# EAGLE design IRIS1304_v2.22 (EAGLE 6.6.0)

## Sheet 1 of 4
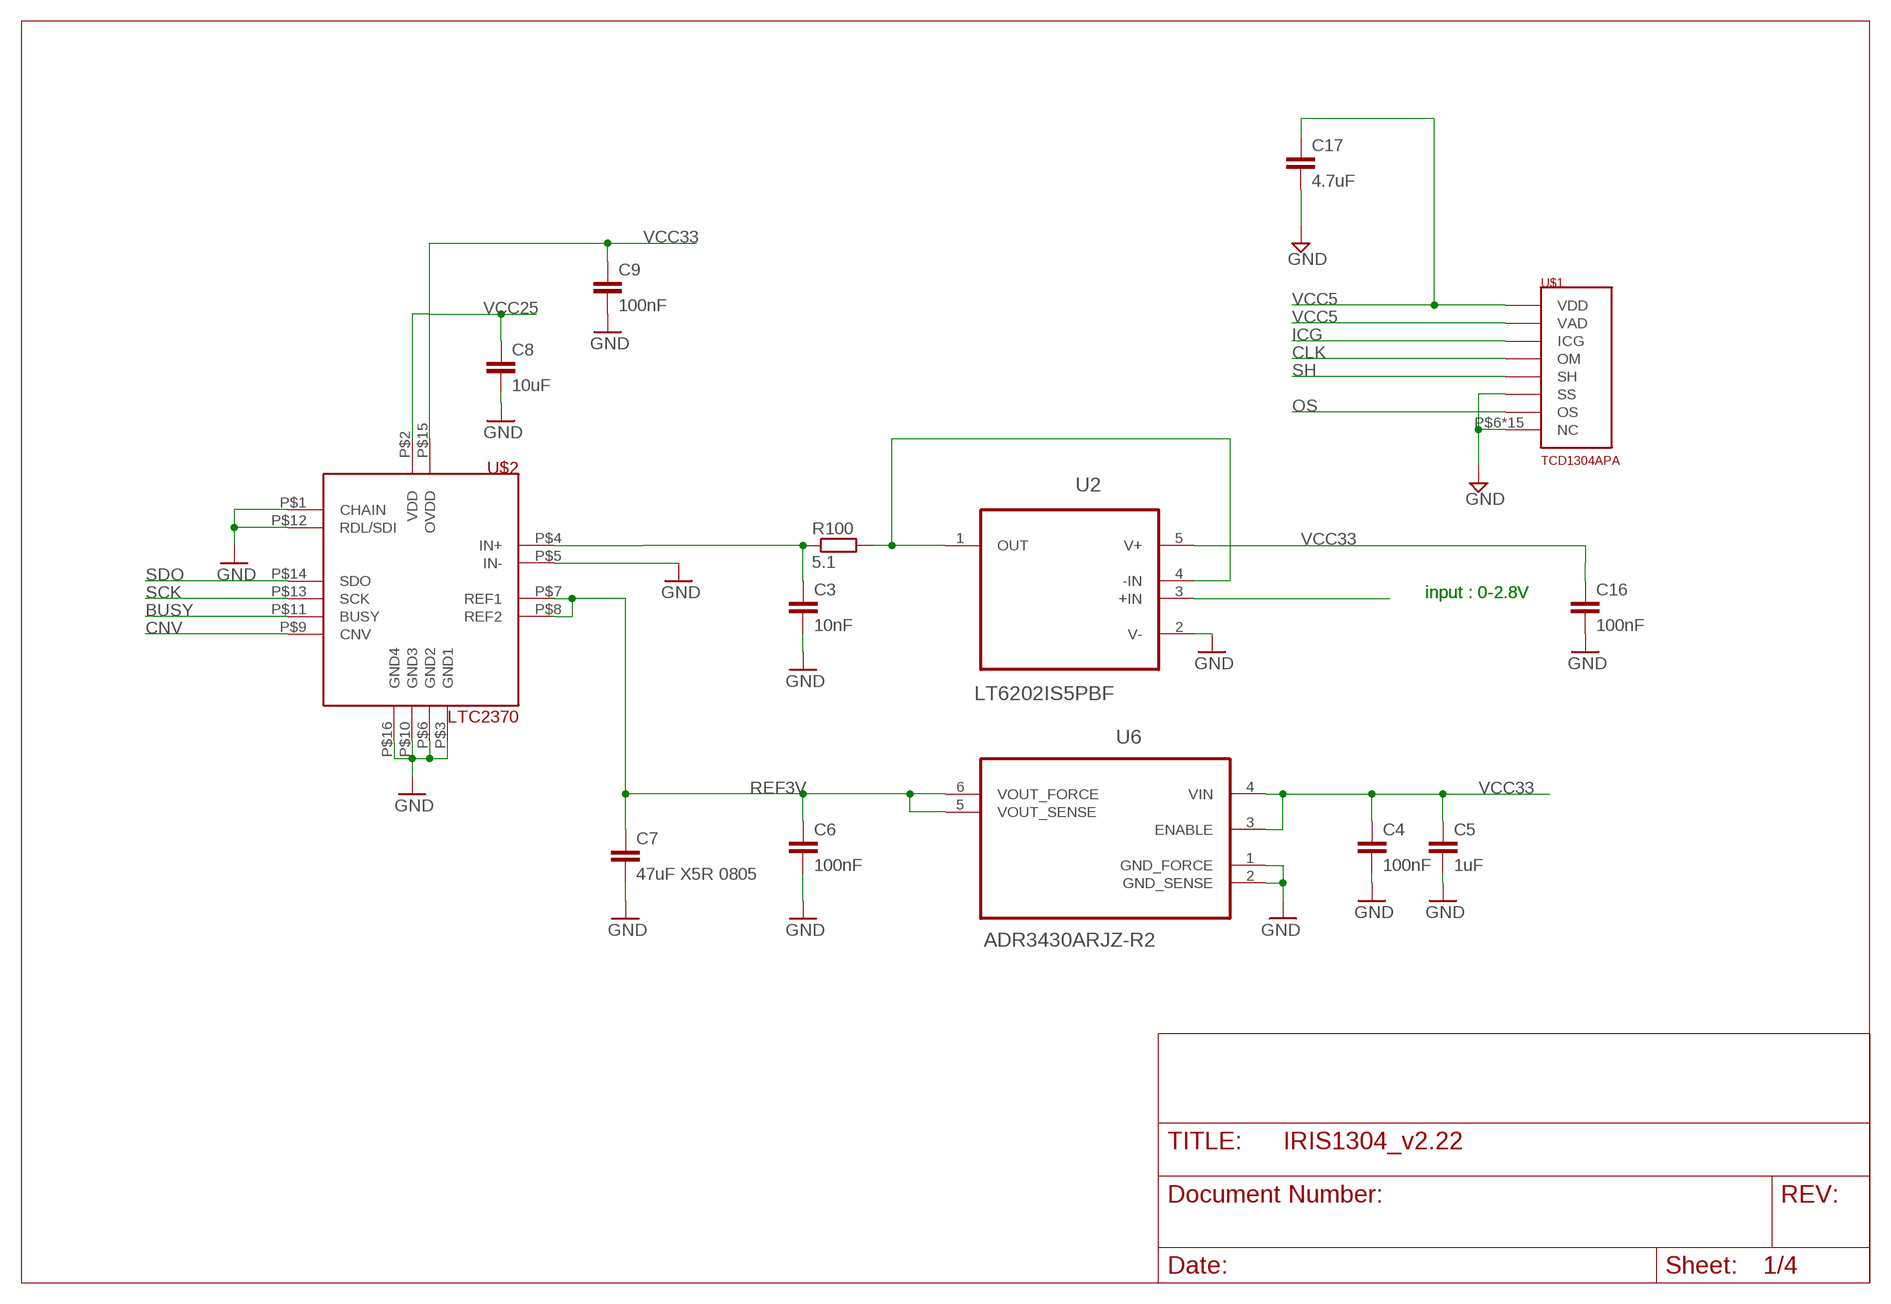
[diagram p0: schematic, sheet 1]

### Parts
C3  10nF  C-EUC0603  [C0603]
C4  100nF  C-EUC0603  [C0603]
C5  1uF  C-EUC0603  [C0603]
C6  100nF  C-EUC0603  [C0603]
C7  47uF X5R 0805  C-EUC0805  [C0805]
C8  10uF  C-EUC0603  [C0603]
C9  100nF  C-EUC0603  [C0603]
C16  100nF  C-EUC0603  [C0603]
C17  4.7uF  C-EUC0603  [C0603]
R100  5.1  R-EU_R0603  [R0603]
U2  LT6202IS5PBF  [SOT95P280X100-5N]
U6  ADR3430ARJZ-R2  [SOT95P280X145-6N]
U$1  TCD1304APA  [ILX511]
U$2  LTC2370  [MSOP-16]

### Nets
BUSY: U$2.P$11(BUSY) ; also sheet 2
CLK: U$1.P$4(OM) ; also sheet 2
CNV: U$2.P$9(CNV) ; also sheet 2
GND: C3.2 C4.2 C5.2 C6.2 C7.2 C8.2 C9.2 C16.2 C17.2 U2.2(V-) U6.1(GND_FORCE) U6.2(GND_SENSE) U$1.P$6(NC) U$1.P$7(NC) U$1.P$8(NC) U$1.P$9(NC) U$1.P$10(NC) U$1.P$11(NC) U$1.P$12(NC) U$1.P$13(NC) U$1.P$14(NC) U$1.P$15(NC) U$1.P$16(NC) U$1.P$17(NC) U$1.P$18(NC) U$1.P$19(NC) U$1.P$20(NC) U$1.P$22(SS) U$2.P$1(CHAIN) U$2.P$3(GND1) U$2.P$5(IN-) U$2.P$6(GND2) U$2.P$10(GND3) U$2.P$12(RDL/SDI) U$2.P$16(GND4) ; also sheet 2,3,4
ICG: U$1.P$3(ICG) ; also sheet 2
N$3: C3.1 R100.1 U$2.P$4(IN+)
N$11: R100.2 U2.1(OUT) U2.4(-IN)
OS: U2.3(+IN) U$1.P$21(OS)
REF3V: C6.1 C7.1 U6.5(VOUT_SENSE) U6.6(VOUT_FORCE) U$2.P$7(REF1) U$2.P$8(REF2)
SCK: U$2.P$13(SCK) ; also sheet 2
SDO: U$2.P$14(SDO) ; also sheet 2
SH: U$1.P$5(SH) ; also sheet 2
VCC5: C17.1 U$1.P$1(VDD) U$1.P$2(VAD) ; also sheet 3,4
VCC25: C8.1 U$2.P$2(VDD) ; also sheet 4
VCC33: C4.1 C5.1 C9.1 C16.1 U2.5(V+) U6.3(ENABLE) U6.4(VIN) U$2.P$15(OVDD) ; also sheet 2,3,4

### Notes on the sheet
- input : 0-2.8V | input : 0-2.8V

## Sheet 2 of 4
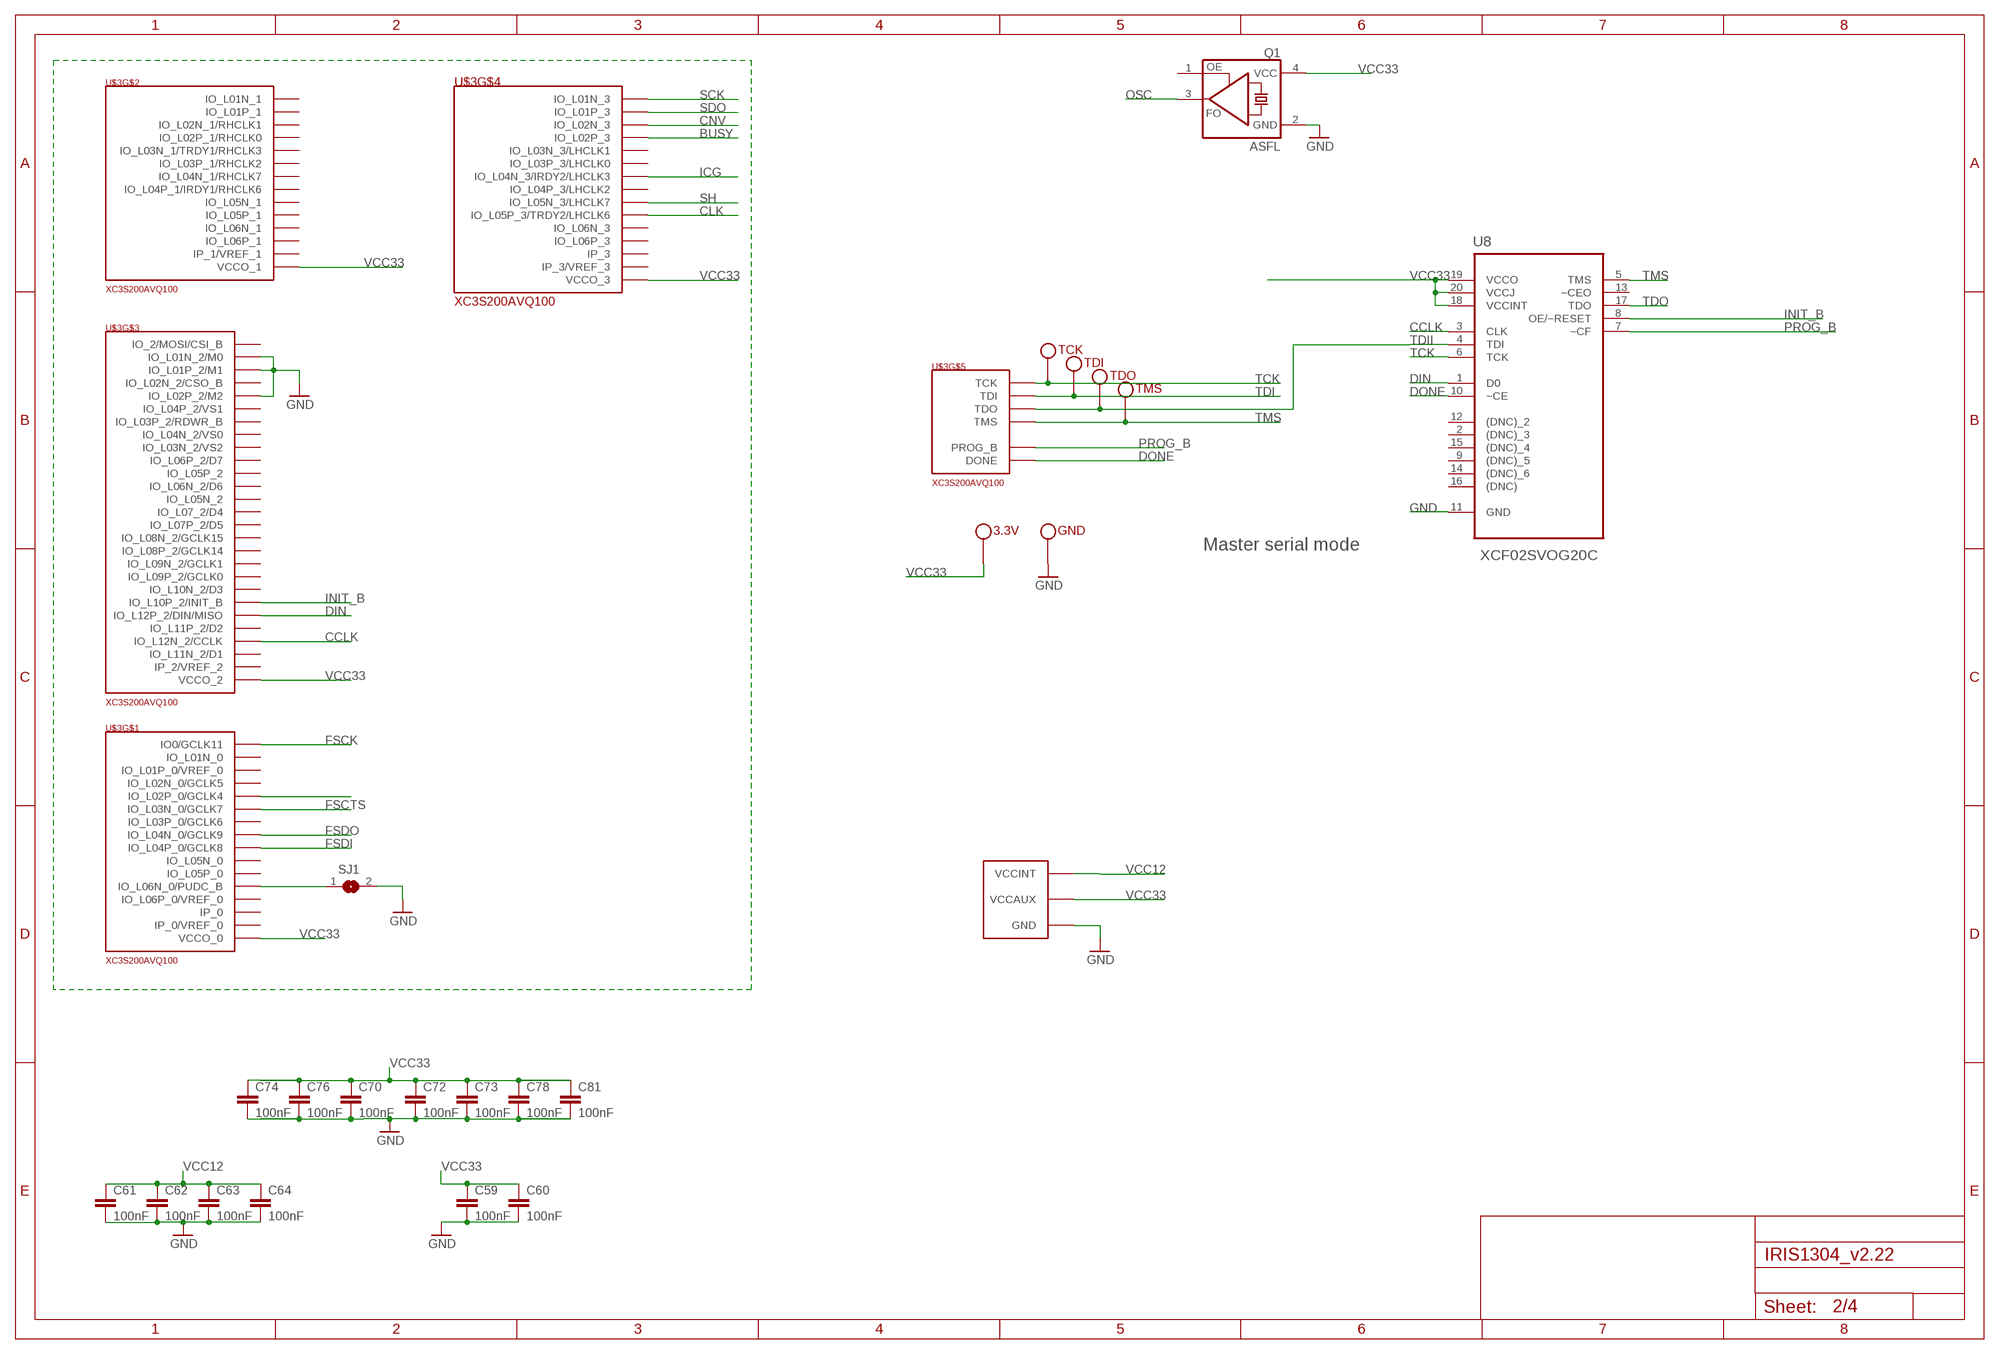
[diagram p1: schematic, sheet 2]

### Parts
3.3V  TEST  [TEST]
C59  100nF  C-EUC0603  [C0603]
C60  100nF  C-EUC0603  [C0603]
C61  100nF  C-EUC0603  [C0603]
C62  100nF  C-EUC0603  [C0603]
C63  100nF  C-EUC0603  [C0603]
C64  100nF  C-EUC0603  [C0603]
C70  100nF  C-EUC0603  [C0603]
C72  100nF  C-EUC0603  [C0603]
C73  100nF  C-EUC0603  [C0603]
C74  100nF  C-EUC0603  [C0603]
C76  100nF  C-EUC0603  [C0603]
C78  100nF  C-EUC0603  [C0603]
C81  100nF  C-EUC0603  [C0603]
GND  TEST  [TEST]
Q1  ASFL  [ASF]
SJ1  SJ  [SJ]
TCK  TEST  [TEST]
TDI  TEST  [TEST]
TDO  TEST  [TEST]
TMS  TEST  [TEST]
U8  XCF02SVOG20C  [SOP65P640X119-20N]
U$3  XC3S200AVQ100  [VQ100]

### Nets
BUSY: U$3.P5(IO_L02P_3) ; also sheet 1
CCLK: U8.3(CLK) U$3.P53(IO_L12N_2/CCLK)
CLK: U$3.P15(IO_L05P_3/TRDY2/LHCLK6) ; also sheet 1
CNV: U$3.P6(IO_L02N_3) ; also sheet 1
DIN: U8.1(D0) U$3.P51(IO_L12P_2/DIN/MISO)
DONE: U8.10(~CE) U$3.P54(DONE)
FSCK: U$3.P90(IO0/GCLK11) ; also sheet 3
FSCTS: U$3.P86(IO_L03N_0/GCLK7) ; also sheet 3
FSDI: U$3.P88(IO_L04P_0/GCLK8) ; also sheet 3
FSDO: U$3.P89(IO_L04N_0/GCLK9) ; also sheet 3
GND: C59.2 C60.2 C61.2 C62.2 C63.2 C64.2 C70.2 C72.2 C73.2 C74.2 C76.2 C78.2 C81.2 GND.P$1 Q1.2(GND) SJ1.2 U8.11(GND) U$3.P8(GND) U$3.P14(GND) U$3.P18(GND) U$3.P23(IO_L01P_2/M1) U$3.P24(IO_L02P_2/M2) U$3.P25(IO_L01N_2/M0) U$3.P42(GND) U$3.P47(GND) U$3.P58(GND) U$3.P63(GND) U$3.P69(GND) U$3.P74(GND) U$3.P80(GND) U$3.P87(GND) U$3.P91(GND) U$3.P95(GND) ; also sheet 1,3,4
ICG: U$3.P13(IO_L04N_3/IRDY2/LHCLK3) ; also sheet 1
INIT_B: U8.8(OE/~RESET) U$3.P48(IO_L10P_2/INIT_B)
N$1: SJ1.1 U$3.P99(IO_L06N_0/PUDC_B)
OSC: Q1.3(FO) U$3.P83(IO_L02P_0/GCLK4)
PROG_B: U8.7(~CF) U$3.P100(PROG_B)
SCK: U$3.P4(IO_L01N_3) ; also sheet 1
SDO: U$3.P3(IO_L01P_3) ; also sheet 1
SH: U$3.P16(IO_L05N_3/LHCLK7) ; also sheet 1
TCK: TCK.P$1 U8.6(TCK) U$3.P76(TCK)
TDI: TDI.P$1 U$3.P2(TDI)
TDII: TDO.P$1 U8.4(TDI) U$3.P75(TDO)
TDO: U8.17(TDO)
TMS: TMS.P$1 U8.5(TMS) U$3.P1(TMS)
VCC12: C61.1 C62.1 C63.1 C64.1 U$3.P17(VCCINT) U$3.P38(VCCINT) U$3.P66(VCCINT) U$3.P81(VCCINT) ; also sheet 4
VCC33: 3.3V.P$1 C59.1 C60.1 C70.1 C72.1 C73.1 C74.1 C76.1 C78.1 C81.1 Q1.4(VCC) U8.18(VCCINT) U8.19(VCCO) U8.20(VCCJ) U$3.P11(VCCO_3) U$3.P22(VCCAUX) U$3.P26(VCCO_2) U$3.P45(VCCO_2) U$3.P55(VCCAUX) U$3.P67(VCCO_1) U$3.P79(VCCO_0) U$3.P92(VCCAUX) U$3.P96(VCCO_0) ; also sheet 1,3,4
Unconnected: Q1.1(OE) U8.2((DNC)_3) U8.9((DNC)_5) U8.12((DNC)_2) U8.13(~CEO) U8.14((DNC)_6) U8.15((DNC)_4) U8.16((DNC)) U$3.P7(IP_3/VREF_3) U$3.P9(IO_L03P_3/LHCLK0) U$3.P10(IO_L03N_3/LHCLK1) U$3.P12(IO_L04P_3/LHCLK2) U$3.P19(IO_L06P_3) U$3.P20(IO_L06N_3) U$3.P21(IP_3) U$3.P27(IO_L02N_2/CSO_B) U$3.P28(IO_L03P_2/RDWR_B) U$3.P29(IO_L03N_2/VS2) U$3.P30(IO_L04P_2/VS1) U$3.P31(IO_L04N_2/VS0) U$3.P32(IO_L05P_2) U$3.P33(IO_L05N_2) U$3.P34(IO_L06P_2/D7) U$3.P35(IO_L06N_2/D6) U$3.P36(IO_L07P_2/D5) U$3.P37(IO_L07_2/D4) U$3.P39(IP_2/VREF_2) U$3.P40(IO_L08P_2/GCLK14) U$3.P41(IO_L08N_2/GCLK15) U$3.P43(IO_L09P_2/GCLK0) U$3.P44(IO_L09N_2/GCLK1) U$3.P46(IO_2/MOSI/CSI_B) U$3.P49(IO_L10N_2/D3) U$3.P50(IO_L11P_2/D2) U$3.P52(IO_L11N_2/D1) U$3.P56(IO_L01P_1) U$3.P57(IO_L01N_1) U$3.P59(IO_L02P_1/RHCLK0) U$3.P60(IO_L02N_1/RHCLK1) U$3.P61(IO_L03P_1/RHCLK2) U$3.P62(IO_L03N_1/TRDY1/RHCLK3) U$3.P64(IO_L04P_1/IRDY1/RHCLK6) U$3.P65(IO_L04N_1/RHCLK7) U$3.P68(IP_1/VREF_1) U$3.P70(IO_L05P_1) U$3.P71(IO_L05N_1) U$3.P72(IO_L06P_1) U$3.P73(IO_L06N_1) U$3.P77(IO_L01P_0/VREF_0) U$3.P78(IO_L01N_0) U$3.P82(IP_0/VREF_0) U$3.P84(IO_L02N_0/GCLK5) U$3.P85(IO_L03P_0/GCLK6) U$3.P93(IO_L05P_0) U$3.P94(IO_L05N_0) U$3.P97(IP_0) U$3.P98(IO_L06P_0/VREF_0)

### Notes on the sheet
- Master serial mode

## Sheet 3 of 4
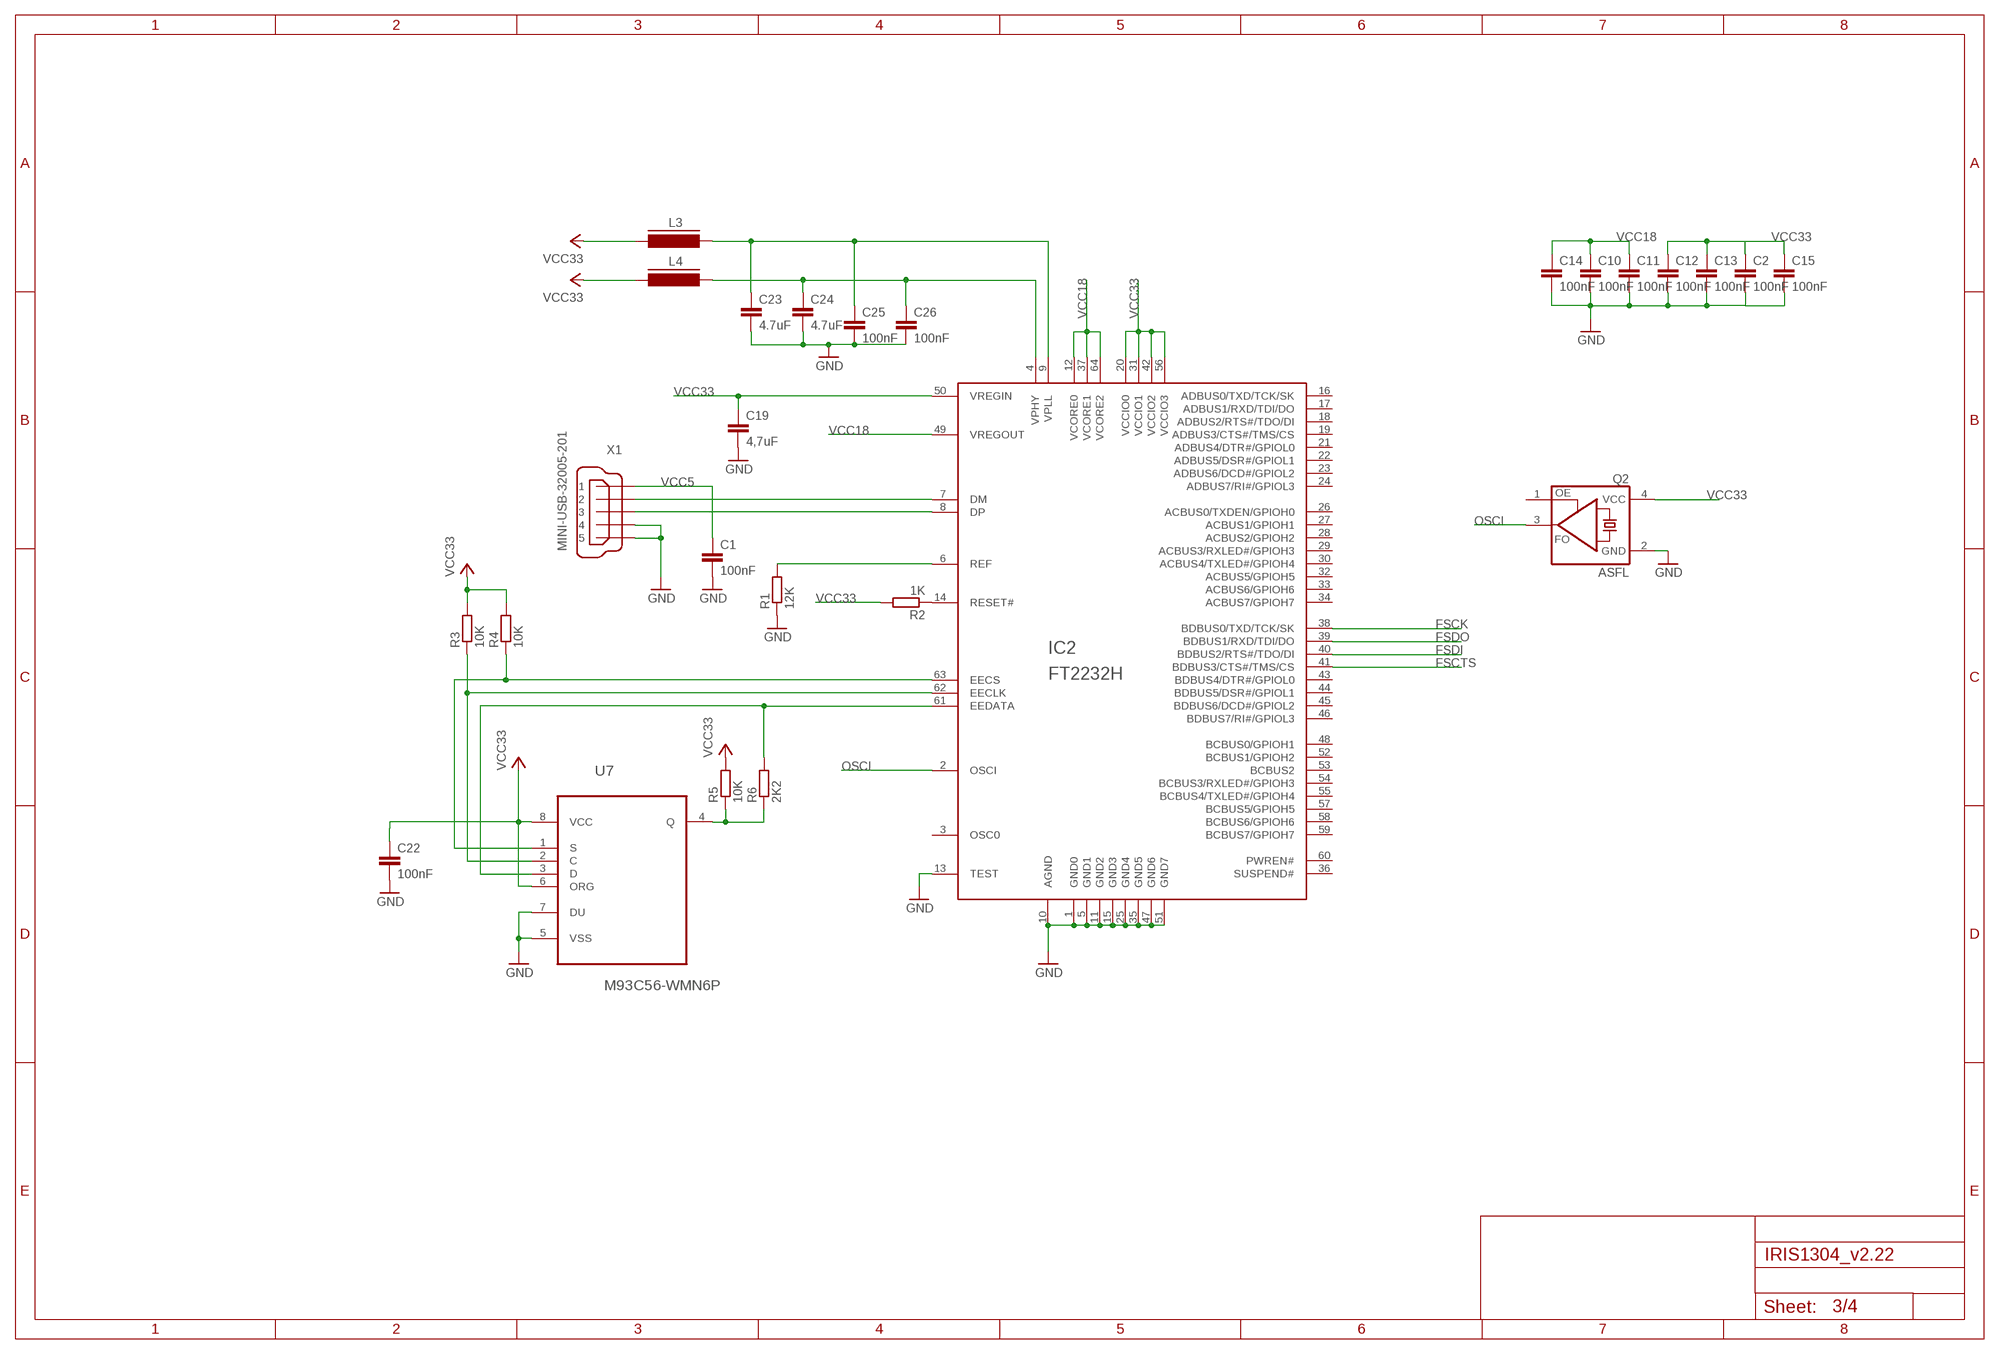
[diagram p2: schematic, sheet 3]

### Parts
C1  100nF  C-EUC0603  [C0603]
C2  100nF  C-EUC0603  [C0603]
C10  100nF  C-EUC0603  [C0603]
C11  100nF  C-EUC0603  [C0603]
C12  100nF  C-EUC0603  [C0603]
C13  100nF  C-EUC0603  [C0603]
C14  100nF  C-EUC0603  [C0603]
C15  100nF  C-EUC0603  [C0603]
C19  4,7uF  C-EUC0805  [C0805]
C22  100nF  C-EUC0603  [C0603]
C23  4.7uF  C-EUC0603  [C0603]
C24  4.7uF  C-EUC0603  [C0603]
C25  100nF  C-EUC0603  [C0603]
C26  100nF  C-EUC0603  [C0603]
IC2  FT2232H  [LQFP64]
L3  FERRITE_BEAD805  [FB805]
L4  FERRITE_BEAD805  [FB805]
Q2  ASFL  [ASF]
R1  12K  R-EU_R0603  [R0603]
R2  1K  R-EU_R0603  [R0603]
R3  10K  R-EU_R0603  [R0603]
R4  10K  R-EU_R0603  [R0603]
R5  10K  R-EU_R0603  [R0603]
R6  2K2  R-EU_R0603  [R0603]
U7  M93C56-WMN6P  [SOIC127P600X175-8N]
X1  MINI-USB-32005-201  [32005-201]

### Nets
D+: IC2.8(DP) X1.3
D-: IC2.7(DM) X1.2
FSCK: IC2.38(BDBUS0/TXD/TCK/SK) ; also sheet 2
FSCTS: IC2.41(BDBUS3/CTS#/TMS/CS) ; also sheet 2
FSDI: IC2.40(BDBUS2/RTS#/TDO/DI) ; also sheet 2
FSDO: IC2.39(BDBUS1/RXD/TDI/DO) ; also sheet 2
GND: C1.2 C2.2 C10.2 C11.2 C12.2 C13.2 C14.2 C15.2 C19.2 C22.2 C23.2 C24.2 C25.2 C26.2 IC2.1(GND0) IC2.5(GND1) IC2.10(AGND) IC2.11(GND2) IC2.13(TEST) IC2.15(GND3) IC2.25(GND4) IC2.35(GND5) IC2.47(GND6) IC2.51(GND7) Q2.2(GND) R1.1 U7.5(VSS) U7.7(DU) X1.4 X1.5 ; also sheet 1,2,4
N$8: IC2.6(REF) R1.2
N$9: R5.1 R6.1 U7.4(Q)
N$12: IC2.61(EEDATA) R6.2 U7.3(D)
N$13: IC2.63(EECS) R4.1 U7.1(S)
N$17: IC2.62(EECLK) R3.1 U7.2(C)
N$18: C24.1 C26.1 IC2.4(VPHY) L4.1
N$19: C23.1 C25.1 IC2.9(VPLL) L3.1
N$20: IC2.14(RESET#) R2.1
OSCI: IC2.2(OSCI) Q2.3(FO)
VCC5: C1.1 X1.1 ; also sheet 1,4
VCC18: C10.1 C11.1 C14.1 IC2.12(VCORE0) IC2.37(VCORE1) IC2.49(VREGOUT) IC2.64(VCORE2)
VCC33: C2.1 C12.1 C13.1 C15.1 C19.1 C22.1 IC2.20(VCCIO0) IC2.31(VCCIO1) IC2.42(VCCIO2) IC2.50(VREGIN) IC2.56(VCCIO3) L3.2 L4.2 Q2.4(VCC) R2.2 R3.2 R4.2 R5.2 U7.6(ORG) U7.8(VCC) ; also sheet 1,2,4
Unconnected: IC2.3(OSC0) IC2.16(ADBUS0/TXD/TCK/SK) IC2.17(ADBUS1/RXD/TDI/DO) IC2.18(ADBUS2/RTS#/TDO/DI) IC2.19(ADBUS3/CTS#/TMS/CS) IC2.21(ADBUS4/DTR#/GPIOL0) IC2.22(ADBUS5/DSR#/GPIOL1) IC2.23(ADBUS6/DCD#/GPIOL2) IC2.24(ADBUS7/RI#/GPIOL3) IC2.26(ACBUS0/TXDEN/GPIOH0) IC2.27(ACBUS1/GPIOH1) IC2.28(ACBUS2/GPIOH2) IC2.29(ACBUS3/RXLED#/GPIOH3) IC2.30(ACBUS4/TXLED#/GPIOH4) IC2.32(ACBUS5/GPIOH5) IC2.33(ACBUS6/GPIOH6) IC2.34(ACBUS7/GPIOH7) IC2.36(SUSPEND#) IC2.43(BDBUS4/DTR#/GPIOL0) IC2.44(BDBUS5/DSR#/GPIOL1) IC2.45(BDBUS6/DCD#/GPIOL2) IC2.46(BDBUS7/RI#/GPIOL3) IC2.48(BCBUS0/GPIOH1) IC2.52(BCBUS1/GPIOH2) IC2.53(BCBUS2) IC2.54(BCBUS3/RXLED#/GPIOH3) IC2.55(BCBUS4/TXLED#/GPIOH4) IC2.57(BCBUS5/GPIOH5) IC2.58(BCBUS6/GPIOH6) IC2.59(BCBUS7/GPIOH7) IC2.60(PWREN#) Q2.1(OE)

## Sheet 4 of 4
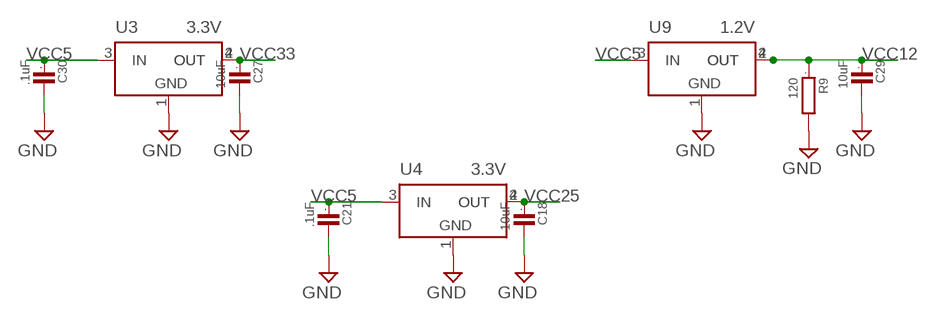
[diagram p3: schematic, sheet 4]

### Parts
C18  10uF  C0805  [0805]
C21  .1uF  C0805  [0805]
C27  10uF  C0805  [0805]
C29  10uF  C0805  [0805]
C30  .1uF  C0805  [0805]
R9  120  R0805  [0805@1]
U3  3.3V  LD1117  [SOT223]
U4  3.3V  LD1117  [SOT223]
U9  1.2V  LD1117  [SOT223]

### Nets
GND: C18.2 C21.2 C27.2 C29.2 C30.2 R9.2 U3.1(GND) U4.1(GND) U9.1(GND) ; also sheet 1,2,3
VCC5: C21.1 C30.1 U3.3(IN) U4.3(IN) U9.3(IN) ; also sheet 1,3
VCC12: C29.1 R9.1 U9.2(OUT) U9.4(OUT) ; also sheet 2
VCC25: C18.1 U4.2(OUT) U4.4(OUT) ; also sheet 1
VCC33: C27.1 U3.2(OUT) U3.4(OUT) ; also sheet 1,2,3

## Library data of the parts
3.3V GND TCK TDI TDO TMS = IRIS lib v1.0:TEST
C1 C3 = rcl:C-EU: CAPACITOR, European symbol; MF: AVX; MPN: 06035G103ZAT2A; OC_FARNELL: 317433
C2 C4 C6 C9-C16 C22 C25 C26 C59-C64 C70 C72-C74 C76 C78 C81 = rcl:C-EU: CAPACITOR, European symbol; MF: AVX; MPN: 06033G104ZAT2A; OC_FARNELL: 317287
C5 = rcl:C-EU: CAPACITOR, European symbol; MF: KEMET; MPN: C0603C105K3PACTU; OC_FARNELL: 1288202
C7 = rcl:C-EU: CAPACITOR, European symbol; MF: KEMET; MPN: C0805C476M9PACTU; OC_FARNELL: 1572633
C8 = rcl:C-EU: CAPACITOR, European symbol; MF: KEMET; MPN: C0603C106M9PACTU; OC_FARNELL: 1288201
C17 C23 C24 = rcl:C-EU: CAPACITOR, European symbol; MF: YAGEO (PHYCOMP); MPN: CC0603KRX5R6BB475; OC_FARNELL: 1458898
C18 C21 C27 C29 C30 = GadgetFactory:C: CAPACITOR, European symbol
C19 = rcl:C-EU: CAPACITOR, European symbol; MF: AVX; MPN: 0805ZD335KAT2A; OC_FARNELL: 1301817
IC2 = DP-EagleLibrary:FT2232H: DUAL HIGH SPEED USB TO MULTIPURPOSE UART/FIFO IC; MF: FTDI; MPN: FT2232HL-R; OC_FARNELL: 1697461
L3 L4 = dp_devices:FERRITE_BEAD; OC_FARNELL: unknown
Q1 Q2 = crystal:ASF*: CRYSTAL CLOCK OSCILLATORS 5.0 Vdc or 3.3 Vdc - LOW PROFILE ULTRA MINIATURE CERAMIC SURFACE MOUNT Source: http://www.abracon.com/Oscillators/asf1-L-L1.pdf; MF: ABRACON; MPN: ASFL1-12.000MHZ-EK-T; OC_FARNELL: 7943088; OC_NEWARK: 99M0411
R1 = rcl:R-EU_: RESISTOR, European symbol; MF: TE CONNECTIVITY; MPN: CPF0201D12K1C1; OC_FARNELL: 2117895
R2 = rcl:R-EU_: RESISTOR, European symbol; MF: VISHAY DRALORIC; MPN: CRCW06031K00FKEA; OC_FARNELL: 1469740
R3-R5 = rcl:R-EU_: RESISTOR, European symbol; MF: TE CONNECTIVITY / NEOHM; MPN: CPF0603F10KC1; OC_FARNELL: 1527581
R6 = rcl:R-EU_: RESISTOR, European symbol; MF: PANASONIC; MPN: ERJP03F2201V; OC_FARNELL: 1750676
R9 = Bogdan_Commons:R: RESISTOR, European symbol
R100 = rcl:R-EU_: RESISTOR, European symbol; MF: VISHAY DALE; MPN: CRCW06035R10FNEA; OC_FARNELL: 1563921
SJ1 = jumper:SJ: SMD solder JUMPER
U2 = SpectroLib:LT6202IS5PBF: Low Power Op Amps; MF: LINEAR TECHNOLOGY; MPN: LT6202IS5#PBF; OC_FARNELL: 2102627; OC_NEWARK: 84R3670; PACKAGE: TSOT-23-5; SUPPLIER: Linear Technology
U3 U4 U9 = GadgetFactory:LD1117
U6 = SpectroLib:ADR3430ARJZ-R2: Voltage References; MF: ANALOG DEVICES; MPN: ADR3430ARJZ-R2; OC_FARNELL: 1899425; OC_NEWARK: 76R7580; PACKAGE: SOT23-6; SUPPLIER: Analog Devices
U7 = IRIS:M93C56-WMN6P: MICROWIRE serial access EEPROM; MF: STMICROELECTRONICS; MPN: M93C56-WMN6P; OC_FARNELL: 9882448; OC_NEWARK: 26M1829; PACKAGE: SOIC-8; SUPPLIER: STMICROELECTRONICS
U8 = QUBIC:XCF02SVOG20C: Platform Flash In-System Programmable Configuration PROMS; DESCRIPTION: Platform Flash In-System Programmable Configuration PROMS; MF: XILINX; MPN: XCF02SVOG20C; OC_FARNELL: 1876178; OC_NEWARK: 40T2691; PACKAGE: TSSOP-20; SUPPLIER: XILINX
U$1 = SpectroLib:TCD1304AP; OC_FARNELL: unknown
U$2 = SpectroLib:LTC2370; MF: LINEAR TECHNOLOGY; MPN: LTC2370CMS-16; OC_FARNELL: 2068071
U$3 = IRIS lib v1.0:XC3S200AVQ100
X1 = con-cypressindustries:MINI-USB-: MINI USB-B Conector Source: www.cypressindustries.com; MF: WURTH ELEKTRONIK; MPN: 65100516121; OC_FARNELL: 1642036; OC_NEWARK: unknown

## Net classes
0 default: width 0.178 mm, drill 0.381 mm, clearance 0.178 mm

## Board
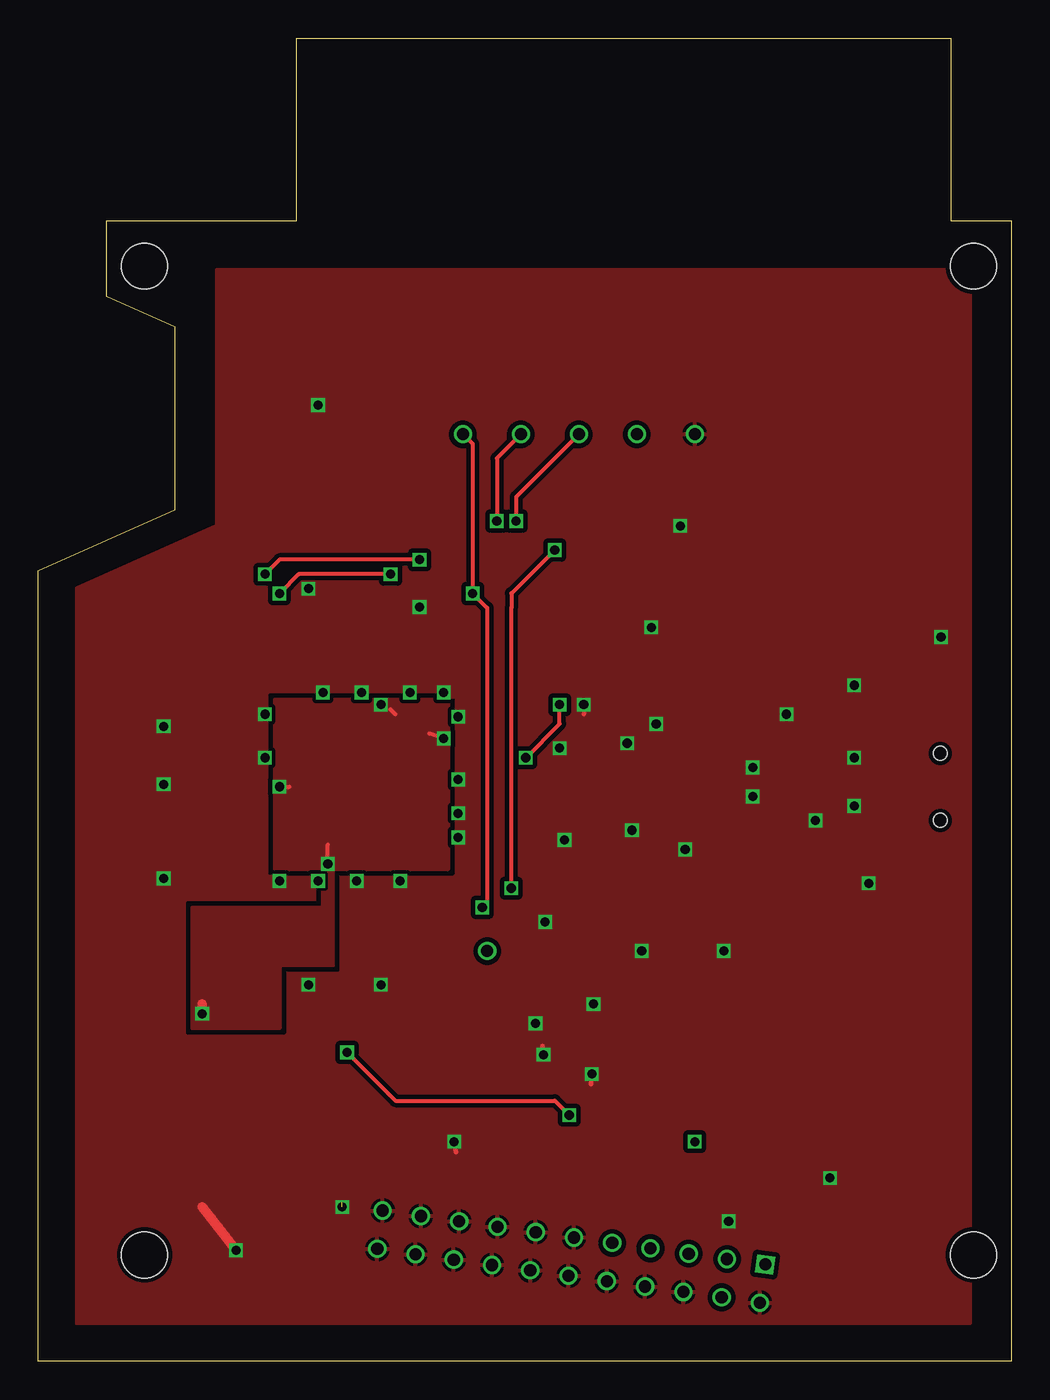
[diagram p4: board, top side]
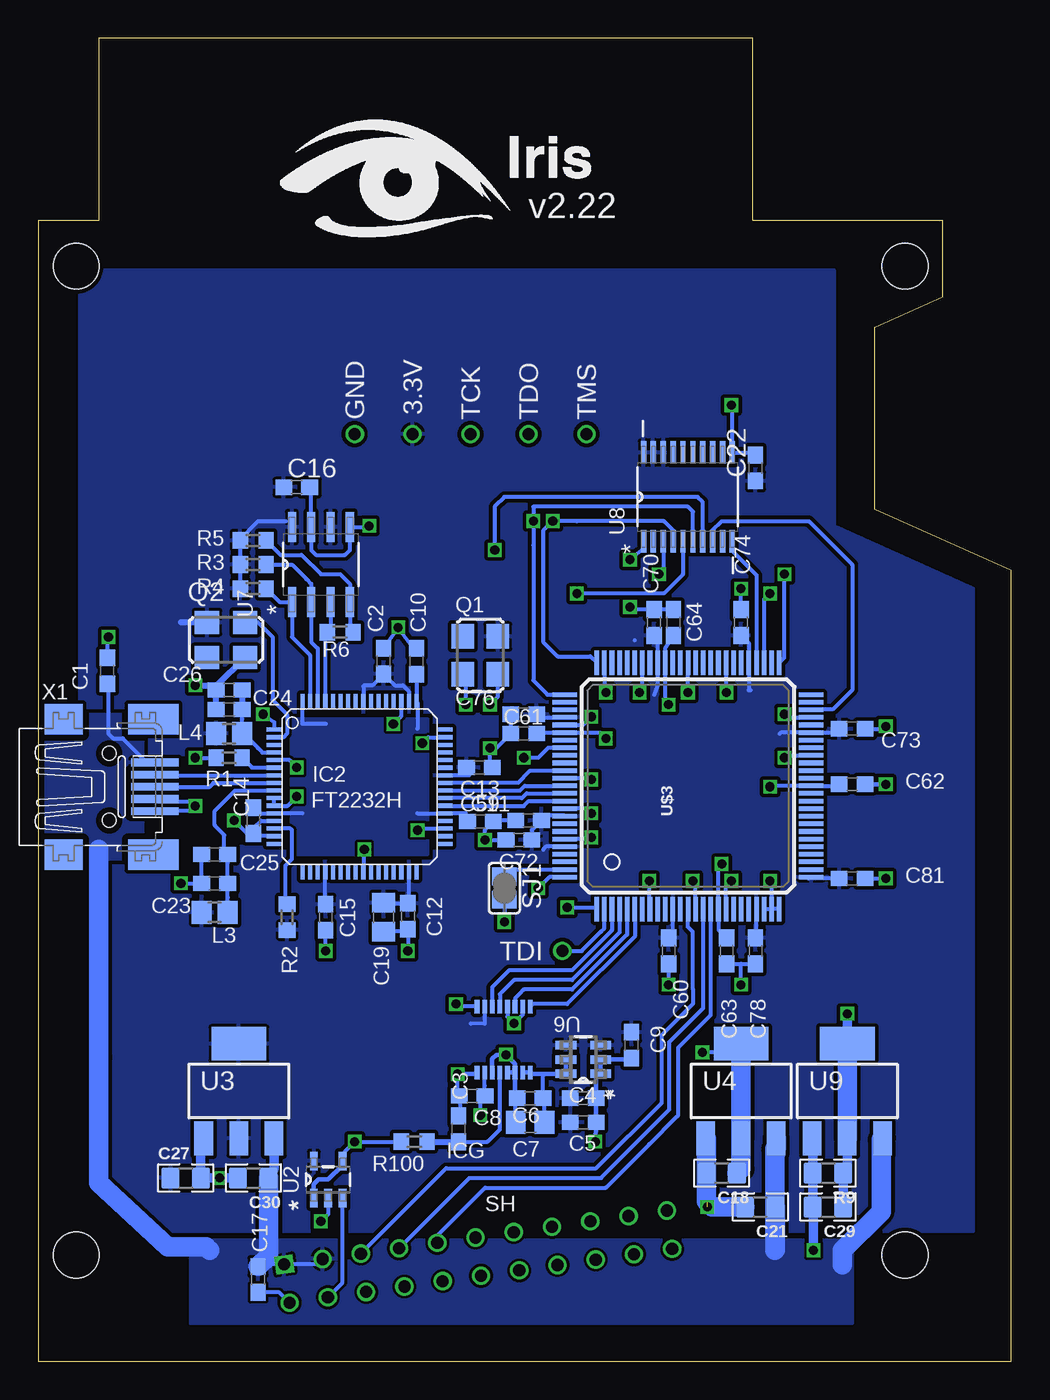
[diagram p5: board, bottom side, seen from below]

Size 64 x 87 mm. Coordinates in mm from the lower left corner, seen from the top.
Outline: 0,0 0,52 9,56 9,68 4.5,70 4.5,75 17,75 17,87 60,87 60,75 64,75 64,0 0,0
Copper layers (1*16): Top 0.035mm / dielectric 1.5mm / Bottom 0.035mm
Design rules "PCB-POOL Standard": minimum track width 0.15mm, minimum drill 0.3mm, track to track 0.15mm, track to pad 0.15mm, pad to pad 0.15mm, via to via 0.15mm, smd to smd 0.15mm, copper to edge 0.3mm, drill to drill 0.2mm, minimum pad ring 0.2mm, minimum via ring 0.15mm, stop-mask expansion 0.075mm, vias tented up to drill 0mil, thermal gap 0.2mm
Holes 3 mm at 7,72 61.5,72 61.5,7 7,7

### Footprints (pad centres in the part's own frame; a part is rotated, then mirrored left to right if it is on the bottom)
TEST = drill 0.8: P$1 0,0
C0603 = smd 1.1 x 1: 1 -0.85,0; 2 0.85,0
C0805 = smd 1.3 x 1.5: 1 -0.95,0; 2 0.95,0
0805 = smd 1.2 x 1.4: 1 -1,0; 2 1,0
LQFP64 = smd 1 x 0.27: 1 -5.6,3.75; 2 -5.6,3.25; 3 -5.6,2.75; 4 -5.6,2.25; 5 -5.6,1.75; 6 -5.6,1.25; 7 -5.6,0.75; 8 -5.6,0.25; 9 -5.6,-0.25; 10 -5.6,-0.75; 11 -5.6,-1.25; 12 -5.6,-1.75; 13 -5.6,-2.25; 14 -5.6,-2.75; 15 -5.6,-3.25; 16 -5.6,-3.75; 33 5.6,-3.75; 34 5.6,-3.25; 35 5.6,-2.75; 36 5.6,-2.25; 37 5.6,-1.75; 38 5.6,-1.25; 39 5.6,-0.75; 40 5.6,-0.25; 41 5.6,0.25; 42 5.6,0.75; 43 5.6,1.25; 44 5.6,1.75; 45 5.6,2.25; 46 5.6,2.75; 47 5.6,3.25; 48 5.6,3.75 | smd 0.27 x 1: 17 -3.75,-5.6; 18 -3.25,-5.6; 19 -2.75,-5.6; 20 -2.25,-5.6; 21 -1.75,-5.6; 22 -1.25,-5.6; 23 -0.75,-5.6; 24 -0.25,-5.6; 25 0.25,-5.6; 26 0.75,-5.6; 27 1.25,-5.6; 28 1.75,-5.6; 29 2.25,-5.6; 30 2.75,-5.6; 31 3.25,-5.6; 32 3.75,-5.6; 49 3.75,5.6; 50 3.25,5.6; 51 2.75,5.6; 52 2.25,5.6; 53 1.75,5.6; 54 1.25,5.6; 55 0.75,5.6; 56 0.25,5.6; 57 -0.25,5.6; 58 -0.75,5.6; 59 -1.25,5.6; 60 -1.75,5.6; 61 -2.25,5.6; 62 -2.75,5.6; 63 -3.25,5.6; 64 -3.75,5.6
FB805 = smd 1.3 x 1.5: 1 -0.85,0; 2 0.85,0
ASF = smd 1.6 x 1.5: 1 -1.25,-1.15; 2 1.25,-1.15; 3 1.25,1.15; 4 -1.25,1.15
R0603 = smd 1 x 1.1: 1 -0.85,0; 2 0.85,0
0805@1 = smd 1.2 x 1.4: 1 -1,0; 2 1,0
SJ = smd 1.168 x 1.6: 1 -0.762,0; 2 0.762,0
SOT95P280X100-5N = smd 1.219 x 0.508: 1 -1.219,0.94; 2 -1.219,0; 3 -1.219,-0.94; 4 1.219,-0.94; 5 1.219,0.94
SOT223 = smd 1.219 x 2.235: 1 -2.311,-3.099; 2 0,-3.099; 3 2.311,-3.099 | smd 3.6 x 2.2: 4 0,3.099
SOT95P280X145-6N = smd 1.372 x 0.559: 1 -1.143,0.94; 2 -1.143,0; 3 -1.143,-0.94; 4 1.143,-0.94; 5 1.143,0; 6 1.143,0.94
SOIC127P600X175-8N = smd 1.981 x 0.533: 1 -2.464,1.905; 2 -2.464,0.635; 3 -2.464,-0.635; 4 -2.464,-1.905; 5 2.464,-1.905; 6 2.464,-0.635; 7 2.464,0.635; 8 2.464,1.905
SOP65P640X119-20N = smd 1.473 x 0.356: 1 -2.921,2.921; 2 -2.921,2.286; 3 -2.921,1.626; 4 -2.921,0.965; 5 -2.921,0.33; 6 -2.921,-0.33; 7 -2.921,-0.965; 8 -2.921,-1.626; 9 -2.921,-2.286; 10 -2.921,-2.921; 11 2.921,-2.921; 12 2.921,-2.286; 13 2.921,-1.626; 14 2.921,-0.965; 15 2.921,-0.33; 16 2.921,0.33; 17 2.921,0.965; 18 2.921,1.626; 19 2.921,2.286; 20 2.921,2.921
ILX511 = drill 0.8 square: P$1 0,0 | drill 0.8: P$2 -2.54,0; P$3 -5.08,0; P$4 -7.62,0; P$5 -10.16,0; P$6 -12.7,0; P$7 -15.24,0; P$8 -17.78,0; P$9 -20.32,0; P$10 -22.86,0; P$11 -25.4,0; P$12 -25.4,-2.54; P$13 -22.86,-2.54; P$14 -20.32,-2.54; P$15 -17.78,-2.54; P$16 -15.24,-2.54; P$17 -12.7,-2.54; P$18 -10.16,-2.54; P$19 -7.62,-2.54; P$20 -5.08,-2.54; P$21 -2.54,-2.54; P$22 0,-2.54
MSOP-16 = smd 0.305 x 0.889: P$1 0,-4.34; P$2 0.5,-4.34; P$3 1,-4.34; P$4 1.5,-4.34; P$5 2,-4.34; P$6 2.5,-4.34; P$7 3,-4.34; P$8 3.5,-4.34; P$9 3.5,0; P$10 3,0; P$11 2.5,0; P$12 2,0; P$13 1.5,0; P$14 1,0; P$15 0.5,0; P$16 0,0
VQ100 = smd 1.6 x 0.3: P1 -8.1,6; P2 -8.1,5.5; P3 -8.1,5; P4 -8.1,4.5; P5 -8.1,4; P6 -8.1,3.5; P7 -8.1,3; P8 -8.1,2.5; P9 -8.1,2; P10 -8.1,1.5; P11 -8.1,1; P12 -8.1,0.5; P13 -8.1,0; P14 -8.1,-0.5; P15 -8.1,-1; P16 -8.1,-1.5; P17 -8.1,-2; P18 -8.1,-2.5; P19 -8.1,-3; P20 -8.1,-3.5; P21 -8.1,-4; P22 -8.1,-4.5; P23 -8.1,-5; P24 -8.1,-5.5; P25 -8.1,-6; P51 8.1,-6; P52 8.1,-5.5; P53 8.1,-5; P54 8.1,-4.5; P55 8.1,-4; P56 8.1,-3.5; P57 8.1,-3; P58 8.1,-2.5; P59 8.1,-2; P60 8.1,-1.5; P61 8.1,-1; P62 8.1,-0.5; P63 8.1,0; P64 8.1,0.5; P65 8.1,1; P66 8.1,1.5; P67 8.1,2; P68 8.1,2.5; P69 8.1,3; P70 8.1,3.5; P71 8.1,4; P72 8.1,4.5; P73 8.1,5; P74 8.1,5.5; P75 8.1,6 | smd 0.3 x 1.6: P26 -6,-8.1; P27 -5.5,-8.1; P28 -5,-8.1; P29 -4.5,-8.1; P30 -4,-8.1; P31 -3.5,-8.1; P32 -3,-8.1; P33 -2.5,-8.1; P34 -2,-8.1; P35 -1.5,-8.1; P36 -1,-8.1; P37 -0.5,-8.1; P38 0,-8.1; P39 0.5,-8.1; P40 1,-8.1; P41 1.5,-8.1; P42 2,-8.1; P43 2.5,-8.1; P44 3,-8.1; P45 3.5,-8.1; P46 4,-8.1; P47 4.5,-8.1; P48 5,-8.1; P49 5.5,-8.1; P50 6,-8.1; P76 6,8.1; P77 5.5,8.1; P78 5,8.1; P79 4.5,8.1; P80 4,8.1; P81 3.5,8.1; P82 3,8.1; P83 2.5,8.1; P84 2,8.1; P85 1.5,8.1; P86 1,8.1; P87 0.5,8.1; P88 0,8.1; P89 -0.5,8.1; P90 -1,8.1; P91 -1.5,8.1; P92 -2,8.1; P93 -2.5,8.1; P94 -3,8.1; P95 -3.5,8.1; P96 -4,8.1; P97 -4.5,8.1; P98 -5,8.1; P99 -5.5,8.1; P100 -6,8.1
32005-201 = smd 3.1 x 0.5: 1 3,1.6; 2 3,0.8; 3 3,0; 4 3,-0.8; 5 3,-1.6 | smd 2.5 x 2: M1 -3,-4.45; M2 -3,4.45 | smd 3.3 x 2: M3 2.9,4.45; M4 2.9,-4.45 | hole 0.9: 0,2.2; 0,-2.2

### Placement (x,y rotation side)
3.3V  39.37,60.96 0 bottom
C1  59.43,45.41 90 bottom
C2  41.27,46.04 90 bottom
C3  36.35,15.29 90 bottom
C4  28.15,17.31 0 bottom
C5  28.15,15.72 0 bottom
C6  31.64,17.31 180 bottom
C7  31.64,15.72 180 bottom
C8  35.45,17.47 180 bottom
C9  24.98,20.8 270 bottom
C10  39.11,46.03 90 bottom
C11  34.92,35.5 0 bottom
C12  39.69,29.27 270 bottom
C13  34.98,39.05 0 bottom
C14  49.85,35.56 270 bottom
C15  45.09,29.21 270 bottom
C16  46.99,57.47 0 bottom
C17  49.53,5.4 270 bottom
C18  19.05,12.38 180 bottom
C19  41.27,29.21 270 bottom
C21  16.51,10.16 180 bottom
C22  16.83,58.74 90 bottom
C23  52.39,31.43 180 bottom
C24  51.44,42.86 180 bottom
C25  52.39,33.34 180 bottom
C26  51.44,44.13 180 bottom
C27  54.29,12.06 0 bottom
C29  12.06,10.16 180 bottom
C30  49.85,12.06 180 bottom
C59  31.75,35.56 180 bottom
C60  22.54,26.99 270 bottom
C61  32.07,41.27 180 bottom
C62  10.48,37.94 0 bottom
C63  18.73,26.99 270 bottom
C64  22.23,48.58 90 bottom
C70  23.5,48.58 90 bottom
C72  32.38,34.29 180 bottom
C73  10.48,41.59 0 bottom
C74  17.78,48.58 90 bottom
C76  32.07,42.55 180 bottom
C78  16.83,26.99 270 bottom
C81  10.48,31.75 0 bottom
GND  43.18,60.96 0 bottom
IC2  42.86,37.78 0 bottom
L3  52.39,29.53 180 bottom
L4  51.44,41.27 180 bottom
Q1  34.92,46.41 270 bottom
Q2  51.64,47.43 0 bottom
R1  51.44,39.69 0 bottom
R2  47.62,29.21 270 bottom
R3  49.85,52.39 180 bottom
R4  49.85,50.8 180 bottom
R5  49.85,53.98 180 bottom
R6  44.13,47.94 180 bottom
R9  12.06,12.38 180 bottom
R100  39.27,14.45 180 bottom
SJ1  33.34,31.11 270 bottom
TCK  35.56,60.96 0 bottom
TDI  29.53,26.99 0 bottom
TDO  31.75,60.96 0 bottom
TMS  27.94,60.96 0 bottom
U2  44.92,11.96 90 bottom
U3  50.8,17.78 0 bottom
U4  17.78,17.78 0 bottom
U6  28.15,19.85 180 bottom
U7  45.4,52.39 90 bottom
U8  21.27,56.83 90 bottom
U9  10.79,17.78 0 bottom
U$1  47.81,6.38 352 top
U$2  35.14,23.34 0 bottom
U$3  21.27,37.84 90 bottom
X1  59.31,37.78 0 bottom

### Tracks (layer width: path | path; a pad name or v marks a point on that pad's centre or on a via)
BUSY
  Bottom 0.254: U$3.P5 25.27,28.07 28.89,24.45 32.07,24.45 32.38,24.13 32.64,23.88 U$2.P$11
CCLK  (via drill 0.6)
  Top 0.254: v23.18,51.75 17.14,51.75 v15.88,50.48
  Bottom 0.254: U8.3 22.9,52.03 v23.18,51.75 | v15.88,50.48 16.27,50.09 U$3.P53
CLK
  Bottom 0.254: U$1.P$4 35.64,12.06 26.99,12.06 22.49,16.56 22.49,21.01 20.32,23.18 20.27,23.23 U$3.P15
CNV
  Bottom 0.254: U$3.P6 24.77,27.94 29.21,23.5 31.48,23.5 U$2.P$9
D+
  Bottom 0.254: X1.3 52.7,37.78 52.45,38.03 IC2.8
D-
  Bottom 0.254: X1.2 56.31,38.53 IC2.7
DIN  (via drill 0.6)
  Top 0.254: v25.08,52.7 15.88,52.7 v14.92,51.75
  Bottom 0.254: U8.1 24.19,53.4 v25.08,52.7 | v14.92,51.75 14.95,51.46 14.95,46.26 U$3.P51
DONE
  Bottom 0.254: U8.10 18.35,53.28 17.14,52.07 16.77,51.69 U$3.P54
FSCK
  Bottom 0.254: IC2.38 37.24,36.51 32.07,36.51 31.74,36.84 U$3.P90
FSCTS
  Bottom 0.254: IC2.41 32.45,38.03 31.64,38.84 U$3.P86
FSDI
  Bottom 0.254: IC2.40 32.32,37.53 32.01,37.84 U$3.P88
FSDO
  Bottom 0.254: IC2.39 32.18,37.03 31.87,37.34 U$3.P89
GND  (via drill 0.6)  (1 unrouted)
  Top 0.254: v35.88,43.18 35.88,42.55
  Top 0.305: v36.41,18.89 36.36,18.2 | v33.23,20.16 33.18,20.74 | v27.36,14.45 27.47,13.76
  Top 0.61: v13.02,7.3 10.79,10.16
  Bottom 0.254: C12.2 39.85,28.26 | 39.85,28.26 C19.2 | C2.2 v40.32,48.26 39.43,47.05 C10.2 | 39.85,28.26 39.69,28.09 v39.69,26.99 | v45.09,26.99 C15.2 | v53.66,39.69 R1.1 | X1.5 53.99,36.18 v53.66,36.51 53.98,36.83 56.16,36.83 X1.4 | v42.23,54.93 42.3,54.85 U7.5 43.5,53.34 43.81,53.02 45.72,53.02 46.04,53.34 U7.7 46.04,57.47 C16.2 | C25.2 53.25,32.79 C23.2 v54.61,31.43 | C11.2 34.13,35.56 | IC2.13 49.34,35.53 49.85,35.03 C14.2 | v51.12,35.56 50.27,34.71 C14.2 | U$2.P$16 36.36,23.34 v36.51,23.5 | U2.2 44.92,9.69 v45.4,9.21 | U$1.P$22 48.14,4.55 C17.2 | C81.2 v8.26,31.75 | C74.2 v17.78,50.8 | C63.2 17.78,26.14 | 17.78,26.14 C78.2 | v17.78,24.77 17.78,26.14 | C11.2 33.97,35.6 | C13.2 34.29,38.88 v34.29,40.32 33.87,40.32 C61.2 C76.2 | v46.99,39.05 47.47,39.53 IC2.5 | v38.73,40.64 38.34,41.03 IC2.47 | v39.05,34.92 38.95,35.03 IC2.35 | v42.55,33.66 42.61,33.59 IC2.25 | v40.64,41.91 40.11,42.44 IC2.51 | IC2.10 IC2.11 47.6,36.53 v46.99,37.15 | IC2.15 49.67,34.53 arc90 C14.2 | v49.21,42.55 48.46,42.02 IC2.1 | C60.2 v22.54,24.77 | U$2.P$12 33.14,22.66 v32.7,22.23 32.14,22.79 U$2.P$10 | C11.2 34.29,35.28 | C3.2 36.15,16.35 C8.2 36.41,17.73 v36.41,18.89 | C7.2 32.59,17.21 C6.2 | C64.2 C70.2 25.4,49.43 25.08,49.43 v25.08,49.59 | C1.2 59.43,47.56 v59.37,47.62 | C22.2 16.99,59.75 U8.11 18.35,62.8 v18.41,62.87 | U$3.P8 23.81,29.79 v23.81,31.59 | U$3.P14 20.77,31.4 v20.95,31.59 | U$3.P25 U$3.P24 | U$3.P23 U$3.P24 | U$3.P24 15.77,31.48 v15.88,31.59 | U$3.P18 18.77,31.24 | 18.77,31.24 v18.41,31.59 18.77,31.24 | U$3.P58 18.77,44.01 v18.73,43.97 | U$3.P74 26.77,44.07 v26.67,43.97 | U$3.P80 28.17,41.84 v27.62,42.39 | v27.62,34.45 27.73,34.34 U$3.P95 | v27.62,36.04 27.93,36.34 U$3.P91
  Bottom 0.254: U$3.P87 27.71,38.34 v27.62,38.26 | C72.2 v34.61,34.29 34.61,34.96 C11.2 | C59.2 34.01,35.56 C11.2 | v21.27,43.97 U$3.P63 | v24.45,43.97 24.27,44.15 U$3.P69 | v14.92,42.55 14.92,42.34 U$3.P47 | v14.92,39.69 14.92,39.84 U$3.P42 | C73.2 8.41,41.59 v8.26,41.75 | Q1.2 35.88,45.04 v35.88,43.18 | SJ1.2 v33.34,28.89
  Bottom 0.305: C5.2 C4.2 | C4.2 27.3,18.61 U6.1 U6.2 24.98,19.85 C9.2 | U$2.P$6 32.64,17.77 C6.2 | U$2.P$1 35.24,18.89 v36.41,18.89 | U$2.P$6 32.64,19.57 v33.23,20.16 33.87,20.16 34.14,19.89 U$2.P$3 | U$2.P$6 U$2.P$5 | C4.2 27.3,15.62 v27.36,14.45 | C62.2 v8.26,37.94
  Bottom 0.406: C24.2 C26.2 | v53.66,44.45 52.6,44.45 C26.2 | C26.2 52.28,44.39 Q2.2
  Bottom 0.61: U9.1 13.06,14.64 R9.2 C29.2 13.02,10.11 v13.02,7.3 | C30.2 v52.07,12.06 C27.2 53.29,14.5 U3.1
  Bottom 1.27: C21.2 19.68,10.16 20,10.48 20.05,10.53 C18.2 20.05,14.64 U4.1
  other vias: 20,10.16
  pour Top (isolate 0.305, rank 6): 2.54,2.54 61.28,2.54 61.28,71.75 11.75,71.75 11.75,54.93 2.54,50.8
ICG
  Bottom 0.254: U$1.P$3 37.17,12.7 27.3,12.7 22.99,17.02 22.99,21.46 20.95,23.5 20.95,24.5 20.95,28.25 21.27,28.57 U$3.P13
INIT_B
  Bottom 0.254: U8.8 19.65,54.65 19.05,55.24 13.34,55.24 10.48,52.39 10.48,44.13 11.75,42.86 13.15,42.86 U$3.P48
N$1
  Bottom 0.254: SJ1.1 33.17,32.34 U$3.P99
N$3
  Bottom 0.254: C3.1 34.45,14.45 33.64,15.26 U$2.P$4
  Bottom 0.305: 33.65,19 U$2.P$4
  Bottom 0.406: R100.1 C3.1
N$8
  Bottom 0.254: R1.2 49.93,39.03 IC2.6
N$9
  Bottom 0.254: R5.1 48.05,53.02 46.67,53.02 45.4,51.75 44.13,51.75 43.5,51.12 U7.4 43.5,48.16 R6.1
N$11  (via drill 0.6)
  Bottom 0.254: U2.4 43.81,13.35 43.81,13.49 43.81,13.81 | 43.81,13.81 v43.18,14.45 | v43.18,14.45 R100.2 | 43.81,13.81 v43.18,14.45
  Bottom 0.305: U2.4 43.98,12.9 44.92,11.96 45.56,11.96 45.88,11.64 45.88,10.75 U2.1
  Bottom 0.406: 45.88,10.74 U2.1
N$12
  Bottom 0.254: U7.3 44.77,48.16 R6.2 45.11,47.81 IC2.61
N$13
  Bottom 0.254: R4.1 48.12,49.92 U7.1 47.31,47.62 46.11,46.43 IC2.63
N$17
  Bottom 0.254: R3.1 47.31,52.39 46.35,51.44 46.04,51.12 U7.2 46.04,47.31 45.61,46.88 IC2.62
N$18
  Bottom 0.254: IC2.4 49.24,40.03 49.53,40.32 50.59,41.38 L4.1 50.57,42.24 C24.1
  Bottom 0.406: C26.1 C24.1
N$19
  Bottom 0.254: L3.1 51.52,30.5 C23.1 51.52,32.79 C25.1 51.75,33.65 51.75,34.61 52.39,35.24 52.39,36.2 51.05,37.53 IC2.9
N$20
  Bottom 0.254: IC2.14 47.41,35.03 47.31,34.92 47.31,33.02 47.73,32.6 47.73,30.16 R2.1
OS
  Bottom 0.254: U$1.P$21 43.98,5.18 U2.3
OSC  (via drill 0.6)
  Top 0.254: v32.07,39.69 34.29,41.91 v34.29,43.18
  Bottom 0.254: U$3.P83 30.46,40.34 31.11,39.69 v32.07,39.69 | v34.29,43.18 33.77,43.7 Q1.3
OSCI
  Bottom 0.254: Q2.3 49.54,48.58 48.58,47.62 48.58,43.5 47.62,42.55 47.62,41.27 47.87,41.03 IC2.2
PROG_B  (via drill 0.6)
  Top 0.254: v31.11,31.11 31.11,49.53 31.11,50.48 v33.97,53.34
  Bottom 0.254: U$3.P100 30.39,31.84 v31.11,31.11 | U8.7 20.32,53.92 20.32,56.52 20.64,56.83 32.38,56.83 33.34,56.83 33.97,56.2 v33.97,53.34
REF3V
  Bottom 0.254: C7.1 30.7,17.21 C6.1 30.8,18.8 30.69,18.91
  Bottom 0.305: U$2.P$7 U$2.P$8 31.55,18.91 30.69,18.91 U6.6 U6.5
SCK
  Bottom 0.254: U$3.P4 25.77,28.21 28.89,25.08 32.7,25.08 33.34,24.45 33.64,24.15 U$2.P$13
SDO
  Bottom 0.254: U$3.P3 26.27,28.34 28.89,25.72 33.02,25.72 33.97,24.77 34.14,24.6 U$2.P$14
SH
  Bottom 0.254: U$1.P$5 37.75,8.29 34.61,11.43 26.67,11.43 23.81,14.29 21.99,16.11 21.91,16.19 21.91,20.64 19.77,22.78 U$3.P16
TCK  (via drill 0.6)
  Top 0.254: TCK.P$1 31.43,56.83 v31.43,55.24
  Bottom 0.254: U8.6 20.94,55.87 21.27,56.2 31.43,56.2 v31.43,55.24 31.43,53.66 31.43,44.77 30.8,44.13 30.51,43.84 U$3.P76
TDI
  Bottom 0.254: TDI.P$1 28.26,26.99 26.99,28.26 26.77,28.48 U$3.P2
TDII  (via drill 0.6)
  Top 0.254: TDO.P$1 30.16,59.37 v30.16,55.24
  Bottom 0.254: U8.4 22.24,54.62 22.86,55.24 28.57,55.24 v30.16,55.24 30.8,54.61 30.8,47.31 29.84,46.35 27.68,46.35 U$3.P75
TMS  (via drill 0.6)
  Top 0.254: v29.21,29.84 29.53,30.16 29.53,49.53 v28.57,50.48 28.57,58.1 28.57,60.33 TMS.P$1
  Bottom 0.254: U8.5 21.6,51.74 22.86,50.48 v28.57,50.48 | v29.21,29.84 27.37,29.84 U$3.P1
VCC5
  Bottom 0.254: X1.1 56.84,39.38 58.42,40.96 59.05,40.96 59.37,41.27 59.37,41.59 59.37,44.4 C1.1 59.44,44.45 | U$1.P$2 45.65,6.38 U$1.P$1 49.72,6.38
  Bottom 0.406: 49.72,6.38 49.53,6.38 C17.1
  Bottom 0.61: U3.3 48.49,12.66 C30.1
  Bottom 1.27: 15.56,13.97 15.56,7.3 15.51,7.35 C21.1 | 60.01,33.66 60.01,20 60.01,11.75 55.47,7.54 52.94,7.54 52.7,7.3 | C30.1 48.85,6.93 C17.1 | 15.56,13.97 15.48,13.73 | 15.56,13.97 15.47,14.06 U4.3 | U9.3 8.57,14.59 8.57,9.84 11.11,7.3 11.11,6.35
  pour Bottom (isolate 0.406): 64.14,42.55 57.15,42.55 57.15,33.02 64.14,33.02 64.14,42.23
  pour Bottom: 10.48,7.94 53.98,7.94 53.98,2.54 10.48,2.54
VCC12  (via drill 0.6)
  Top 0.254: v15.88,37.78 16.51,37.78 | v26.67,40.96 25.72,41.27 | 23.18,42.86 23.5,42.55 | v19.05,32.7 19.05,33.97
  Top 0.61: v10.79,22.86 10.79,23.5
  Bottom 0.254: 18.77,28.19 C63.1 19.27,28.37 U$3.P17 19.27,32.48 v19.05,32.7 | v15.88,37.78 15.81,37.84 U$3.P38 11.59,37.84 C62.1 | v26.67,40.96 27.05,41.34 U$3.P81 30.83,41.34 C61.1 | v22.54,43.18 22.77,43.59 U$3.P66 22.77,46.87 C64.1
  Bottom 0.61: C29.1 R9.1 10.79,12.65 U9.2 | U9.4 v10.79,22.86
  Bottom 1.27: U9.2 U9.4
  pour Top (isolate 0.254, rank 2): 26.99,43.5 15.56,43.5 15.56,32.38 26.99,32.38
  pour Top (rank 3): 10.16,21.91 10.16,29.84 18.73,29.84 18.73,32.38 19.37,32.38 19.37,26.04 15.88,26.04 15.88,21.91
VCC18
  Bottom 0.254: 39.05,41.59 39.05,43.32 IC2.49 39.11,44.87 C10.1 | 39.05,36.03 IC2.37 35.87,36.03 C11.1 | 45.09,41.91 46.61,41.91 IC2.64 | 46.61,36.03 IC2.12 49.47,36.03 C14.1
  pour Bottom (rank 2): 38.42,42.23 38.42,33.34 47.31,33.34 47.31,42.23
VCC25  (via drill 0.6)
  Top 0.254: v20.32,20.32 23.5,17.14 33.97,17.14 v34.92,16.19
  Bottom 0.254: 34.61,19.03 U$2.P$2 34.64,18.13 C8.1 34.92,16.99 v34.92,16.19 | U4.4 18.34,20.32 v20.32,20.32
  Bottom 1.27: U4.4 U4.2 17.78,12.65 C18.1
VCC33
  Bottom 0.254: C15.1 45.11,30.09 IC2.20 | IC2.31 39.61,30.2 C12.1 41.23,30.12 C19.1 | C13.1 35.64,38.53 IC2.42 | U$2.P$15 34.64,22.2 35.56,22.23 | IC2.50 39.61,44.06 40.01,44.45 40.54,44.45 C2.1 42.01,44.45 42.55,44.45 42.61,44.38 IC2.56 | R4.2 R3.2 R5.2 50.06,54.71 49.53,55.24 47.7,55.24 | 24.77,47.41 | 15.24,41.27 15.17,41.34 U$3.P45 11.89,41.34 C73.1 | C78.1 16.77,27.9 U$3.P22 | C60.1 22.27,28.11 U$3.P11 | U$3.P96 30.61,33.84 30.8,33.66 | 13.34,31.75 11.43,31.75 C81.1 | C76.1 31.1,42.34 U$3.P79 | U$3.P92 29.4,35.88 30.58,35.88 C59.1 31.54,34.92 C72.1 | C70.1 23.27,47.5 | 23.27,47.5 U$3.P67 | C74.1 17.27,47.22 U$3.P55 17.27,44.13 17.14,44.13 | 23.27,47.5 23.27,44.45 23.5,43.81
  Bottom 0.406: Q2.4 54.6,48.58 54.61,48.58
  pour Bottom (isolate 0.254, rank 6): 11.68,71.75 11.68,54.93 2.54,50.8 2.54,8.57 61.21,8.57 61.21,71.75

### Text on the board
bPlace: v2.22 | ICG | SH